# Altium schematic sheet Main.SchDoc
size A4; SheetNumber: 1; SheetTotal: 5
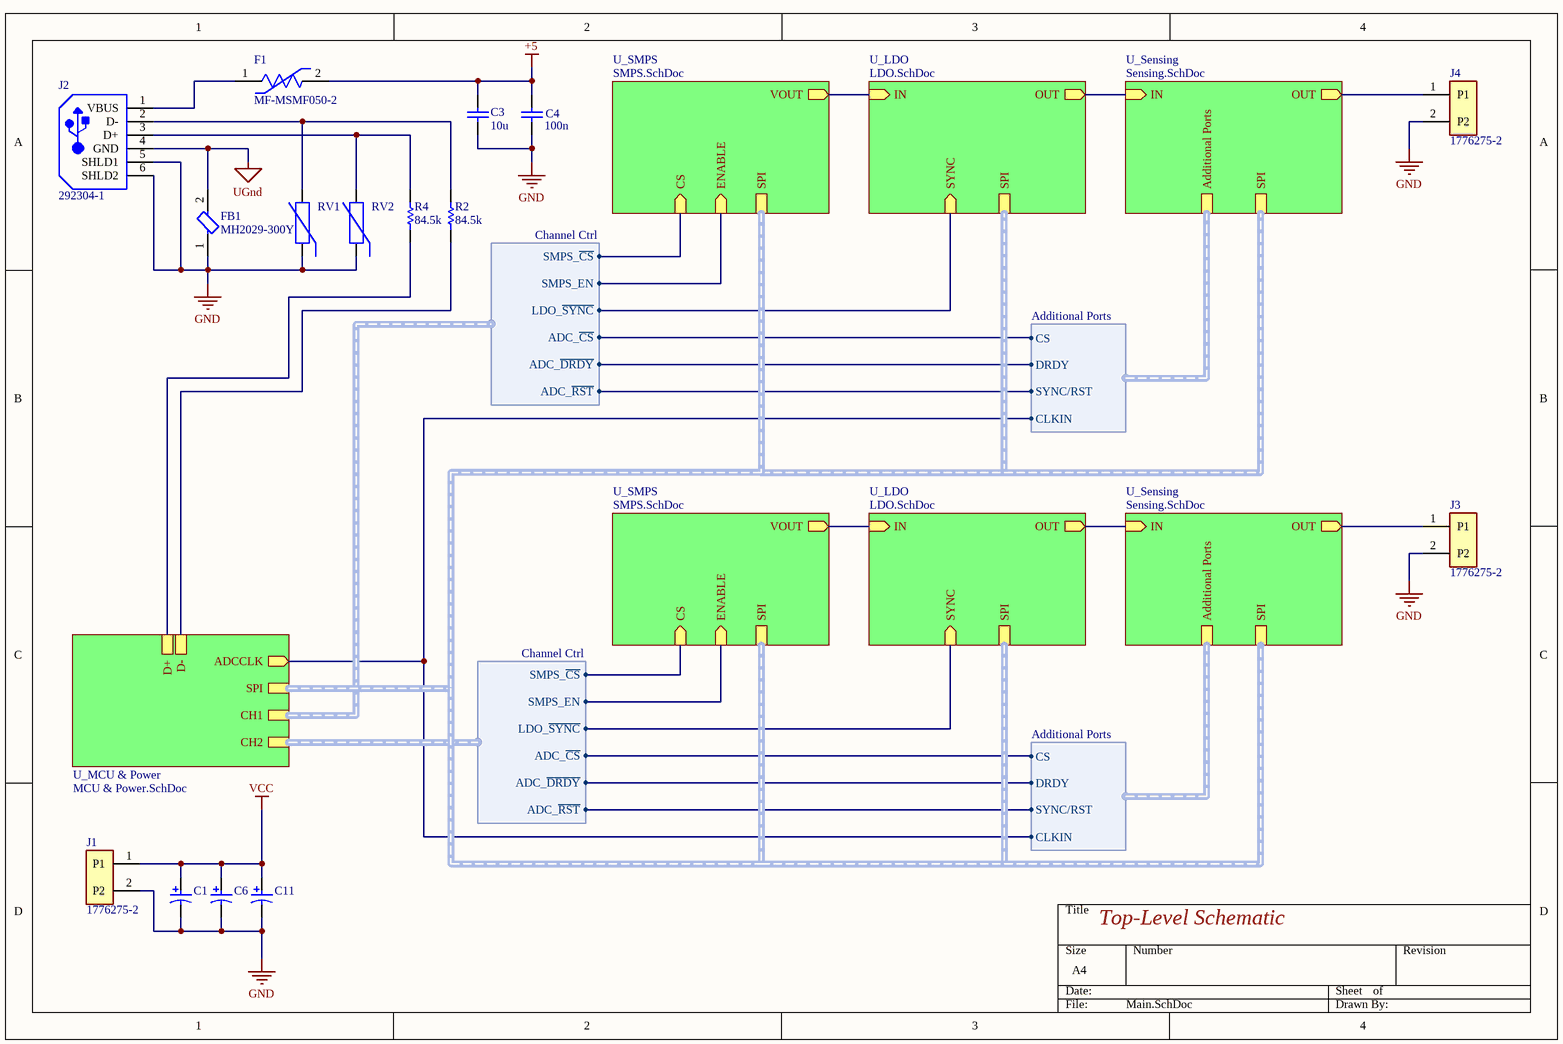
[diagram p0: Main.SchDoc]

## Parts
C1  ECA-1JHG471  [CAPPR65-500-2000X1250X2200]  (value not drawn)
C3  10u  [CAPC3216X180X55LL20T30]
C4  100n  [CAPC2013X145X50LL20T25]
C6  ECA-1JHG471  [CAPPR65-500-2000X1250X2200]  (value not drawn)
C11  ECA-1JHG471  [CAPPR65-500-2000X1250X2200]  (value not drawn)
F1  MF-MSMF050-2  [FP-MF-MSMF050-2-MFG]
FB1  MH2029-300Y  [FP-MH2029-MFG]
J1  1776275-2  [TE_1776275-2]
J2  292304-1  [TECO-292304-1-4_V]
J3  1776275-2  [TE_1776275-2]
J4  1776275-2  [TE_1776275-2]
R2  84.5k  [RESC2013X60X35NL10T20]
R4  84.5k  [RESC2013X60X35NL10T20]
RV1  CG0603MLC-05E  [BOUR-CG0603-2_V]  (value not drawn)
RV2  CG0603MLC-05E  [BOUR-CG0603-2_V]  (value not drawn)

## Sub-sheets
U_LDO = LDO.SchDoc: IN (in), OUT (out), SPI (harness SPI Common), SYNC (in)
U_LDO = LDO.SchDoc: IN (in), OUT (out), SPI (harness SPI Common), SYNC (in)
U_MCU & Power = MCU & Power.SchDoc: ADCCLK (out), CH1 (harness Channel Ctrl), CH2 (harness Channel Ctrl), SPI (harness SPI Common), D-, D+
U_Sensing = Sensing.SchDoc: IN (in), OUT (out), Additional Ports (harness Additional Ports), SPI (harness SPI Common)
U_Sensing = Sensing.SchDoc: IN (in), OUT (out), Additional Ports (harness Additional Ports), SPI (harness SPI Common)
U_SMPS = SMPS.SchDoc: CS (in), ENABLE (in), VOUT (out), SPI (harness SPI Common)
U_SMPS = SMPS.SchDoc: CS (in), ENABLE (in), VOUT (out), SPI (harness SPI Common)

## Harnesses
Channel Ctrl: ADC_~{CS}, ADC_~{DRDY}, ADC_~{RST}, SMPS_~{CS}, SMPS_EN, LDO_~{SYNC}
Additional Ports: CLKIN, CS, DRDY, SYNC/RST

## Nets
+5: C3.2 C4.2 F1.2
GND: C1.2 C3.1 C4.1 C6.2 C11.2 FB1.1 J1.2(P2) J2.5(SHLD1) J2.6(SHLD2) J3.2(P2) J4.2(P2) RV1.1 RV2.1
UGnd: FB1.2 J2.4(GND)
VCC: C1.1 C6.1 C11.1 J1.1(P1)
NetF1_1: F1.1 J2.1(VBUS)
NetJ2_2: J2.2(D-) R2.2 RV1.2
NetJ2_3: J2.3(D+) R4.2 RV2.2
NetJ3_1: J3.1(P1) ; sheet U_Sensing/OUT
NetJ4_1: J4.1(P1) ; sheet U_Sensing/OUT
NetR2_1: R2.1 ; sheet U_MCU & Power/D-
NetR4_1: R4.1 ; sheet U_MCU & Power/D+
(unnamed): sheet U_MCU & Power/ADCCLK, sheet U_Sensing/Additional Ports.CLKIN
(unnamed): sheet U_SMPS/CS, sheet U_MCU & Power/CH1.SMPS_~{CS}
(unnamed): sheet U_SMPS/ENABLE, sheet U_MCU & Power/CH1.SMPS_EN
(unnamed): sheet U_SMPS/VOUT, sheet U_LDO/IN
(unnamed): sheet U_LDO/OUT, sheet U_Sensing/IN
(unnamed): sheet U_LDO/SYNC, sheet U_MCU & Power/CH1.LDO_~{SYNC}
(unnamed): sheet U_SMPS/CS, sheet U_MCU & Power/CH2.SMPS_~{CS}
(unnamed): sheet U_SMPS/ENABLE, sheet U_MCU & Power/CH2.SMPS_EN
(unnamed): sheet U_SMPS/VOUT, sheet U_LDO/IN
(unnamed): sheet U_LDO/OUT, sheet U_Sensing/IN
(unnamed): sheet U_LDO/SYNC, sheet U_MCU & Power/CH2.LDO_~{SYNC}
(unnamed): sheet U_MCU & Power/CH1.ADC_~{CS}, sheet U_Sensing/Additional Ports.CS
(unnamed): sheet U_MCU & Power/CH1.ADC_~{DRDY}, sheet U_Sensing/Additional Ports.DRDY
(unnamed): sheet U_MCU & Power/CH1.ADC_~{RST}, sheet U_Sensing/Additional Ports.SYNC/RST
(unnamed): sheet U_MCU & Power/CH2.ADC_~{CS}, sheet U_Sensing/Additional Ports.CS
(unnamed): sheet U_MCU & Power/CH2.ADC_~{DRDY}, sheet U_Sensing/Additional Ports.DRDY
(unnamed): sheet U_MCU & Power/CH2.ADC_~{RST}, sheet U_Sensing/Additional Ports.SYNC/RST

## Buses and harness runs
harness sheet U_LDO/SPI = sheet U_MCU & Power/SPI = sheet U_Sensing/SPI = sheet U_SMPS/SPI

## Notes on the sheet
- Top-Level Schematic

## Library data of the parts
C1 C6 C11 = CMP-1665-00014-4: Aluminum Electrolytic Capacitor (Radial Lead Type), 470 uF, 63 V, -55 to 105 degC, 2-Pin THD, RoHS, Bulk; Manufacturer: Panasonic; Voltage Rating: 63 V; Lead Pitch: 5 mm; ComponentLink2URL: http://industrial.panasonic.com/cdbs/www-data/pdf/RDF0000/ABA0000C1038.pdf; DatasheetVersion: 03/2016; ComponentLink1URL: http://www.panasonic.com/; Mount: Through Hole; Max Operating Temperature: 105 degC; Pins: 2; Packaging: Bulk; ComponentLink1Description: Manufacturer URL; Height: 20 mm; REACH SVHC: No SVHC; RoHSCompliant: true; Mounting Technology: Through Hole; PackageDescription: 2-Pin Through Hole Device, Dia 12.5 mm, Body Length 20 mm; Package Quantity: 200; Min Operating Temperature: -55 degC; PackageReference: Radial; ComponentLink2Description: Datasheet; Length: 20 mm
C3 = CMP-2000-07261-1: High Value Multilayer Ceramic Capacitor, 10 uF, +/- 10%, 25 V, -55 to 125 degC, 1206 (3216 Metric), RoHS, Tape and Reel; Manufacturer: Taiyo Yuden; Catalog Drawings: xMKSeries_1206_1.6; Temperature Coefficient: X7R; Other Names: 587-2399-6; Capacitance: 10µF; Online Catalog: MSeries; Voltage - Rated: 25V; Package / Case: 1206(3216Metric); Thickness (Max): 0.071"(1.80mm); Tolerance: ±10%; Category: Capacitors; Size / Dimension: 0.126"Lx0.063"W(3.20mmx1.60mm); Lead Spacing: -; Standard Package: 1; Applications: GeneralPurpose; Features: -; Package Description: 2-Pin Surface Mount Device, Body 3.2 x 1.6 mm; Package Reference: 1206; Datasheet Version: 07/2015; Lead Style: -; Manufacturer URL: http://www.t-yuden.com/; Mounting Technology: SurfaceMount; Height - Seated (Max): -; Mounting Type: SurfaceMount,MLCC; Datasheet URL: http://datasheet.octopart.com/TMK316B7106KL-TD-Taiyo-Yuden-datasheet-62109620.pdf; Operating Temperature: -55°C~125°C; Series: M; Ratings: -; Packaging: Digi-Reel®; Family: CeramicCapacitors
C4 = CMP-2007-01136-1: Manufacturer: Kemet; Part Number: C0805C104K3RALTU
F1 = CMP-2100-03653-2: PTC RESET FUSE 15V 500MA 1812; Manufacturer: Bourns; Value: 0.15-1Ω; Trip Current: 1A; Automotive Grade: Grade 3; Trip Time: 0.15s; Current Rating: 100A; Hold Current: 0.5A; Height: 0.85mm; Package: 1812; Voltage Rating: 15V; Temperature Range High: +85°C; Device Class L2: PTC Resettable Fuses; Lead Free: Yes; ComponentLink2URL: http://www.bourns.com/docs/Product-Datasheets/mfmsmf.pdf; Ambient Temperature Range High: +85°C; Mouser Description: PTC Resettable Fuse 0.5A(hold) 1A(trip) 15V 100A 0.8W 0.15s 0.15Ohm SMD Solder Pad 1812 T/R; Digikey Description: PTC RESET FUSE 15V 500MA 1812; Manufacturer Part Number: MF-MSMF050-2; Resistance: 0.15-1Ω; Category: Fuse; ComponentLink2Description: Datasheet; Automotive: Yes; Temperature Range Low: -40°C; RoHS: TRUE; Device Class L1: Circuit Protection; Temperature: -40°C to +85°C; Octopart: https://octopart.com/mf-msmf050-2-bourns-28047; Ambient Temperature Range Low: -40°C; Device Class L3: unset
FB1 = CMP-07252-000001-1: FERRITE BEAD 30 OHM 0805 1LN; Manufacturer: Bourns; Series Resistance: 25mΩ; Resistance: 30Ω; Value: 30Ω; Impedance At Frequency: 30Ω @ 100MHz; Rms Current: 3A; Tolerance: 25%; RoHS: TRUE; Manufacturer Part Number: MH2029-300Y; Temperature Range High: +125°C; Device Class L3: Ferrite Beads and Chips; Core Material: Ferrite; ComponentLink2Description: Datasheet; Category: FBead; Octopart: https://octopart.com/mh2029-300y-bourns-756929; Digikey Description: FERRITE BEAD 30 OHM 0805 1LN; Device Class L2: EMI / RFI Components; Lead Free: Yes; Mouser Description: Ferrite Beads 30 ohms 25% HIGH CURRENT; Automotive: No; Ipc Land Pattern Name: CAPC200120X90; Temperature: -55°C to +125°C; Device Class L1: Passive Components; Height: 1.1mm; ComponentLink2URL: https://www.bourns.com/docs/Product-Datasheets/mh.pdf; Package: MH2029; Temperature Range Low: -55°C
J1 J3 J4 = 1776275-2: TERM BLOCK 2POS SIDE ENT 3.5MM; MF: {'manufacturer': u'TE Connectivity'}; Availability: Unavailable; Package: None; Price: None; Value: *; MP: 1776275-2
J2 = CMP-2000-05412-1: 1 Port Right Angle Through Hole Mount Female Type B USB Connector, 4 Position, -55 to 85 degC, RoHS, Tray; Manufacturer: TE Connectivity; USB Connector Type: USBTypeB; Gender: Receptacle; USB Standard: USB2.0; SVHC: ToBeAdvised; No. of Positions: 4; Series: B; Contact Plating: Gold; Orientation: RightAngle; Contact Material: CopperAlloy; Datasheet URL: https://datasheet.ciiva.com/851/eng-cd-292304-d2-851088.pdf; Connector Mounting: ThroughHole; Manufacturer URL: http://www.te.com/; Datasheet Version: Oct-93
R2 R4 = CMP-2001-01285-1: Manufacturer: Yageo; Part Number: RC0805FR-0784K5L
RV1 RV2 = CMP-0584-00001-2: ESD Protector, 5 V Supply, -40 to 85 degC, 1.6 x 0.8 x 0.55 mm SMD, RoHS, Tape and Reel; Manufacturer: Bourns; VC: 20 V; VT: 150 V; RT: 1 ns; VDC: 5 V; CO: 0.5 pF; PartNumber: CG0603MLC-05E; ComponentLink1Description: Manufacturer URL; ComponentLink1URL: http://www.bourns.com/; Packing: Tape and Reel; Mounting Technology: Surface Mount; ComponentLink2Description: Datasheet; RoHS: TRUE; Operating Temperature: -40 to 85 degC; DatasheetVersion: Rev. S; PackageDescription: 2-Pin SMD, Body 1.6 x 0.8 mm, Pitch 1.52 mm; PackageReference: CG0603-2; ComponentLink2URL: http://www.bourns.com/data/global/pdfs/MLC.pdf